# EAGLE design bluetooth-shield (EAGLE 6.5.0)
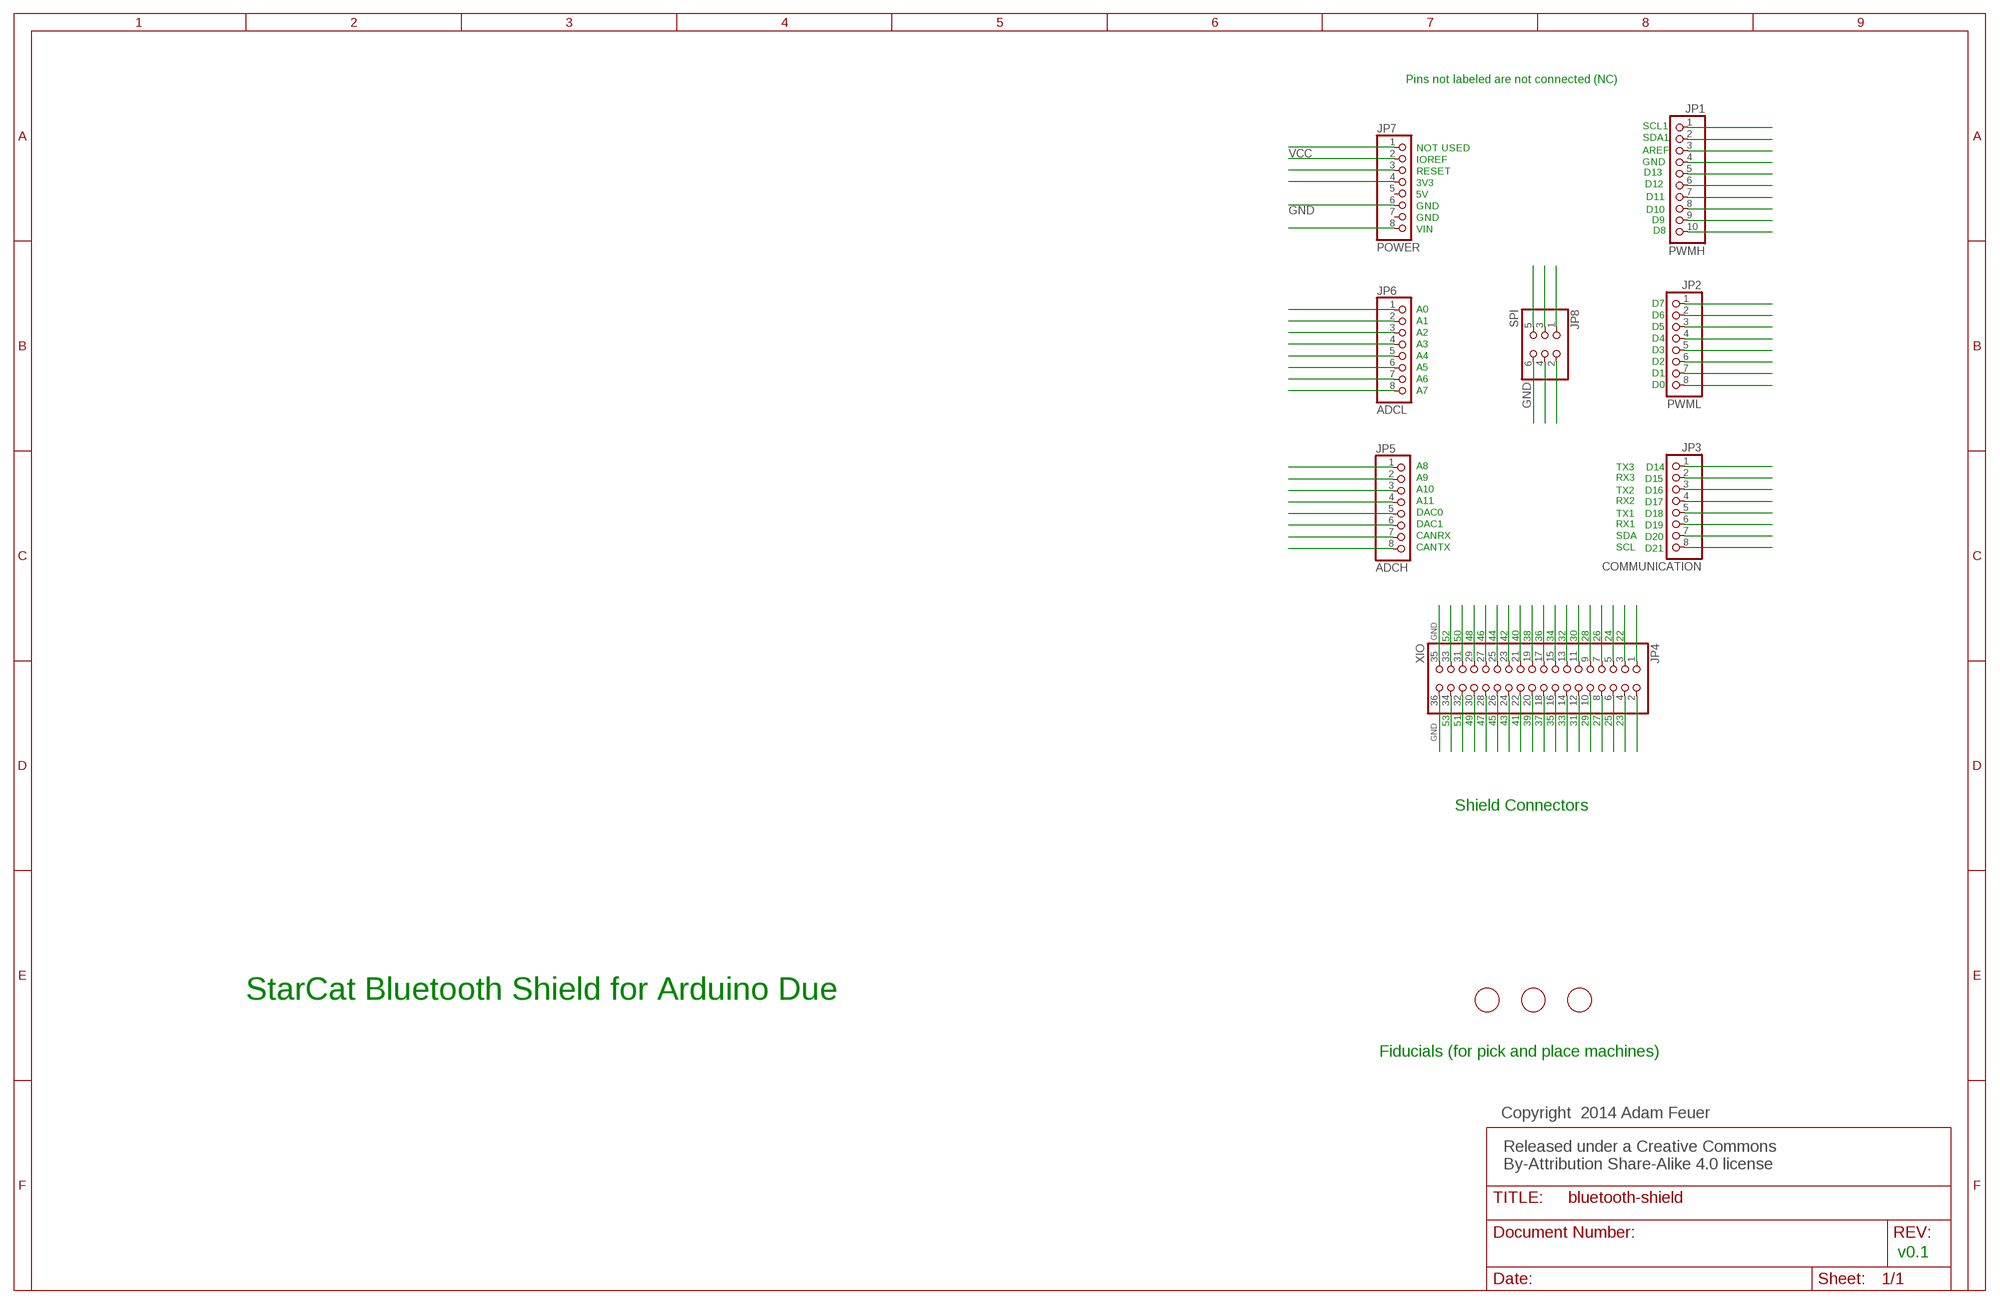
[diagram p0: schematic, sheet 1]

## Parts
JP1  PWMH  PINHD-1X10  [1X10]
JP2  PWML  PINHD-1X8  [1X08]
JP3  COMMUNICATION  PINHD-1X8  [1X08]
JP4  XIO  PINHD-2X18  [2X18]
JP5  ADCH  PINHD-1X8  [1X08]
JP6  ADCL  PINHD-1X8  [1X08]
JP7  POWER  PINHD-1X8  [1X08]
JP8  SPI  PINHD-2X3  [2X03]
U$2  FIDUCIAL  [FIDUCIAL_1MM]
U$5  FIDUCIAL  [FIDUCIAL_1MM]
U$6  FIDUCIAL  [FIDUCIAL_1MM]

## Nets
D38: JP4.19
D39: JP4.20
D40: JP4.21
D41: JP4.22
D42: JP4.23
D43: JP4.24
D44: JP4.25
D45: JP4.26
GND [GND]: JP4.35 JP4.36 JP8.6
N$1: JP1.9
N$2: JP5.1
N$3: JP7.1
N$4: JP3.7
N$5: JP2.7
N$7: JP1.3
N$8: JP1.4
N$9: JP1.5
N$10: JP1.6
N$11: JP1.7
N$12: JP1.10
N$13: JP2.1
N$14: JP2.2
N$15: JP2.3
N$16: JP2.5
N$17: JP2.6
N$18: JP2.8
N$19: JP3.1
N$22: JP3.2
N$25: JP3.5
N$26: JP3.6
N$32: JP3.8
N$37: JP5.8
N$43: JP5.7
N$44: JP5.6
N$55: JP5.5
N$56: JP5.4
N$57: JP5.3
N$58: JP5.2
N$65: JP6.4
N$66: JP6.3
N$68: JP6.2
N$69: JP7.8
N$71: JP7.6
N$72: JP7.3
N$73: JP4.34
N$74: JP4.32
N$89: JP4.18
N$91: JP4.16
N$92: JP4.10
N$93: JP4.3
N$94: JP4.9
N$96: JP4.15
N$97: JP4.17
N$109: JP4.31
N$110: JP6.6
N$112: JP6.7
N$115: JP4.1
N$116: JP4.2
N$569: JP6.8
N$571: JP7.4
N$572: JP6.1
N$573: JP6.5
N$574: JP1.1
N$575: JP1.2
N$576: JP1.8
N$577: JP2.4
N$578: JP3.3
N$579: JP3.4
N$580: JP4.5
N$581: JP4.7
N$582: JP4.11
N$583: JP4.13
N$584: JP4.27
N$585: JP4.29
N$586: JP4.33
N$587: JP4.4
N$588: JP4.6
N$589: JP4.8
N$590: JP4.12
N$591: JP4.14
N$592: JP4.30
N$601: JP4.28
RESET: JP8.5
SPI0_MISO: JP8.1
SPI0_MOSI: JP8.4
SPI0_SCK: JP8.3
VCC: JP7.2
VCC_5V: JP8.2
Unconnected: JP7.5 JP7.7

## Notes on the sheet
- Pins not labeled are not connected (NC)
- SCL1
- SDA1
- NOT USED | AREF
- IOREF | GND
- RESET | D13
- 3V3 | D12
- 5V | D11
- GND
- D10
- GND | D9
- VIN | D8
- D7
- A0
- D6
- A1
- D5
- A2
- D4
- A3
- D3
- A4
- D2
- A5
- D1
- A6
- D0
- A7
- A8 | TX3 | D14
- A9 | RX3 | D15
- A10 | TX2 | D16
- A11 | RX2 | D17
- DAC0 | TX1 | D18
- DAC1 | RX1 | D19
- CANRX | SDA | D20
- CANTX | SCL | D21
- 52 | 50 | 48 | 46 | 44 | 42 | 40 | 38 | 36 | 34 | 32 | 30 | 28 | 26 | 24 | 22
- 53 | 51 | 49 | 47 | 45 | 43 | 41 | 39 | 37 | 35 | 33 | 31 | 29 | 27 | 25 | 23
- Shield Connectors
- StarCat Bluetooth Shield for Arduino Due
- Fiducials (for pick and place machines)
- Copyright  2014 Adam Feuer
- Released under a Creative Commons 
  By-Attribution Share-Alike 4.0 license
- v0.1

## Library data of the parts
JP1 = SmartPrj:PINHD-1X10: PIN HEADER
JP2 JP3 JP5-JP7 = SmartPrj:PINHD-1X8: PIN HEADER
JP4 = SmartPrj:PINHD-2X18: PIN HEADER
JP8 = SmartPrj:PINHD-2X3: PIN HEADER
U$2 U$5 U$6 = adafruit:FIDUCIAL: For use by pick and place machines to calibrate the vision/machine, 1mm By microbuilder.eu

## Net classes
0 USB_A: width 0.305 mm, drill 0.305 mm, clearance 0.508 mm
1 5V: width 0.305 mm, drill 0.305 mm, clearance 0.305 mm
2 GND: width 0.305 mm, drill 0.305 mm, clearance 0.305 mm

## Board
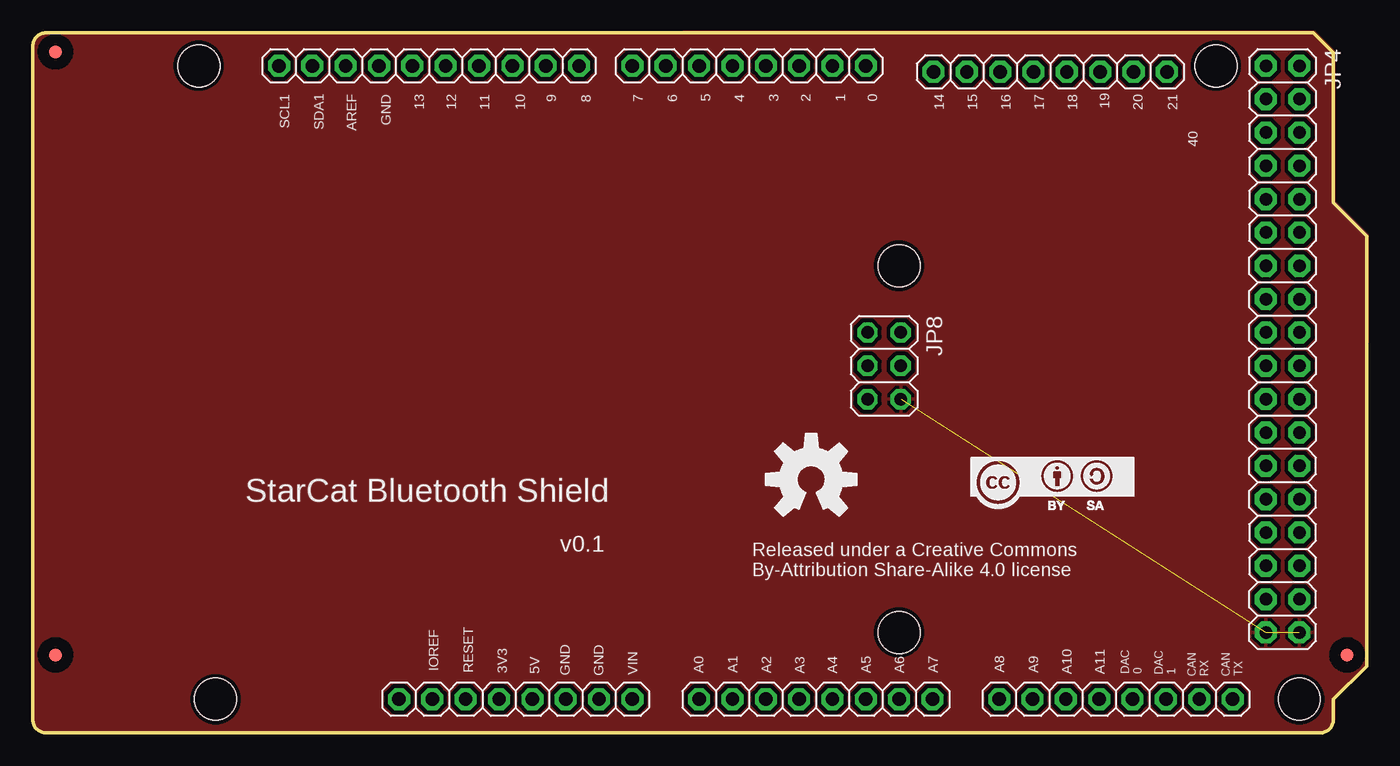
[diagram p1: board, top side]
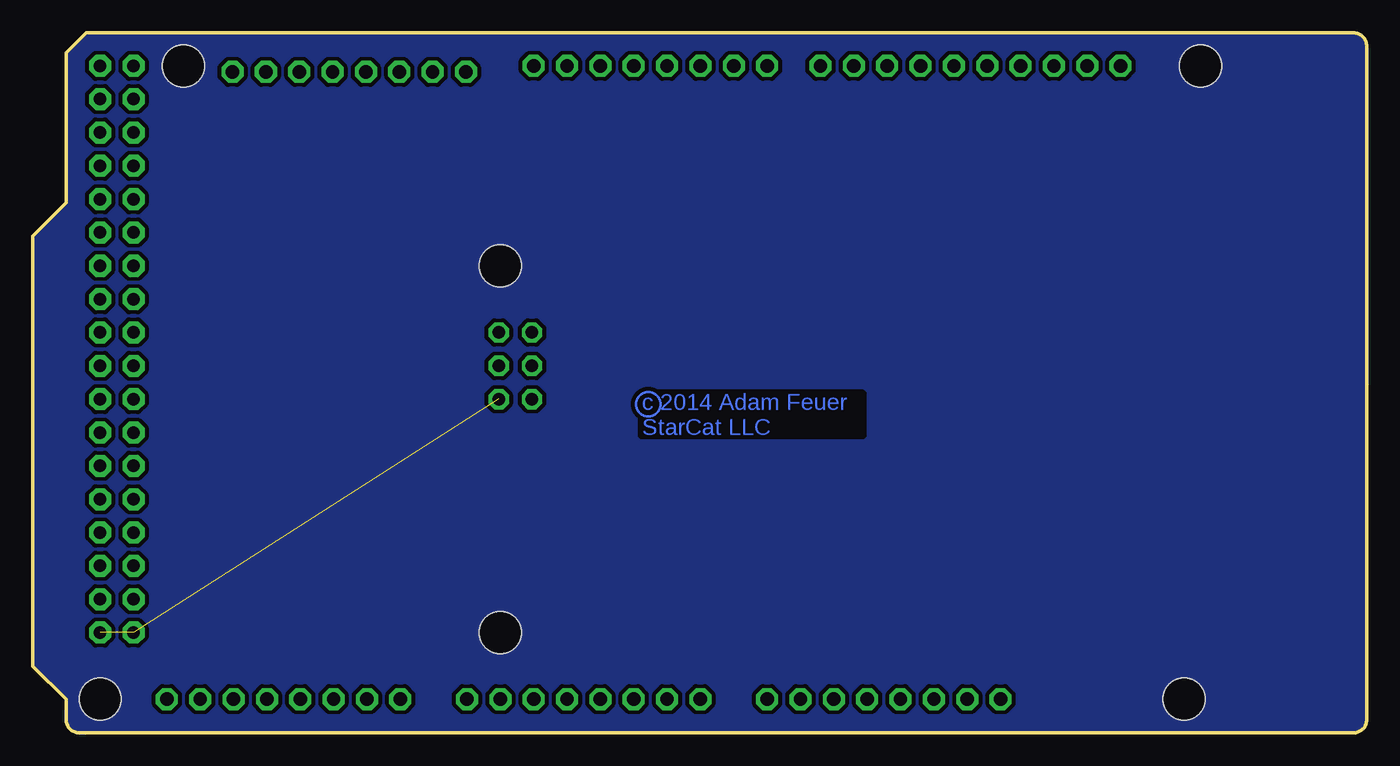
[diagram p2: board, bottom side, seen from below]

Size 101.6 x 53.34 mm. Coordinates in mm from the lower left corner, seen from the top.
Outline: 97.54,53.34 99.06,51.82 99.06,40.39 101.6,37.85 101.6,5.08 99.06,2.54 99.06,1 arc-90 98.06,0 1,0 arc-90 0,1 0,52.34 arc-90 1,53.34 97.54,53.34
Copper layers (1*16): Top 0.0356mm / dielectric 63mil / Bottom 0.0356mm
Design rules "advanced-circuits-2-layer": minimum track width 6mil, minimum drill 15mil, track to track 6mil, track to pad 6mil, pad to pad 6mil, via to via 6mil, smd to smd 6mil, copper to edge 0mil, drill to drill 6mil, minimum pad ring 10mil, minimum via ring 8mil, stop-mask expansion 4mil, vias tented up to drill 0mil, thermal gap 10mil
Holes 3.2 mm at 96.47,2.57 12.65,50.83 90.12,50.83 13.92,2.57 65.99,35.59 65.99,7.65

### Footprints (pad centres in the part's own frame; a part is rotated, then mirrored left to right if it is on the bottom)
1X10 = drill 1.016 pad 1.676 octagon: 1 -11.43,0; 2 -8.89,0; 3 -6.35,0; 4 -3.81,0; 5 -1.27,0; 6 1.27,0; 7 3.81,0; 8 6.35,0; 9 8.89,0; 10 11.43,0
1X08 = drill 1.016 pad 1.676 octagon: 1 -8.89,0; 2 -6.35,0; 3 -3.81,0; 4 -1.27,0; 5 1.27,0; 6 3.81,0; 7 6.35,0; 8 8.89,0
2X18 = drill 0.95 pad 1.676 octagon: 1 -21.59,-1.27; 2 -21.59,1.27; 3 -19.05,-1.27; 4 -19.05,1.27; 5 -16.51,-1.27; 6 -16.51,1.27; 7 -13.97,-1.27; 8 -13.97,1.27; 9 -11.43,-1.27; 10 -11.43,1.27; 11 -8.89,-1.27; 12 -8.89,1.27; 13 -6.35,-1.27; 14 -6.35,1.27; 15 -3.81,-1.27; 16 -3.81,1.27; 17 -1.27,-1.27; 18 -1.27,1.27; 19 1.27,-1.27; 20 1.27,1.27; 21 3.81,-1.27; 22 3.81,1.27; 23 6.35,-1.27; 24 6.35,1.27; 25 8.89,-1.27; 26 8.89,1.27; 27 11.43,-1.27; 28 11.43,1.27; 29 13.97,-1.27; 30 13.97,1.27; 31 16.51,-1.27; 32 16.51,1.27; 33 19.05,-1.27; 34 19.05,1.27; 35 21.59,-1.27; 36 21.59,1.27
2X03 = drill 0.95 pad 1.55 octagon: 1 -2.54,-1.27; 2 -2.54,1.27; 3 0,-1.27; 4 0,1.27; 5 2.54,-1.27; 6 2.54,1.27
FIDUCIAL_1MM = smd 1 x 1: 1 0,0

### Placement (x,y rotation side)
JP1  30.18,50.83 0 top
JP2  54.56,50.83 0 top
JP3  77.5,50.37 0 top
JP4  95.2,29.24 270 top
JP5  82.5,2.57 0 top
JP6  59.64,2.57 0 top
JP7  36.78,2.57 0 top
JP8  64.85,27.97 270 top
U$1  [OSHW-LOGO-L]  59.28,19.3 0 top
U$2  1.73,51.89 0 top
U$5  1.73,5.94 0 top
U$6  100.1,5.94 0 top
U$8  [CC-BY-SA]  71.32,16.71 0 top

### Tracks (layer width: path | path; a pad name or v marks a point on that pad's centre or on a via)
5V
  pour Bottom (rank 3): 1.19,0 97.54,0 arc90 99.09,0.94 99.06,2.54 101.57,5.16 101.6,37.82 99.06,40.39 99.06,51.79 97.28,53.37 1.12,53.34 arc90 -0.03,51.97 0,1.09 0.03,0.86 arc90
GND  (2 unrouted)
  pour Top (isolate 0.305): 0.03,52.4 0.03,1.09 arc90 1.04,0.08 98.07,0.08 arc90 99.09,1.09 99.09,2.59 101.57,5.08 101.63,37.92 99.09,40.46 99.09,51.89 97.56,53.42 1.45,53.34 arc90
(copper drawn outside any net)
  shapes: Bottom circle x1

### Text on the board
Bottom: c 2014 Adam Feuer / StarCat LLC
tPlace: SCL1 | SDA1 | AREF | GND | 13 | 12 | 11 | 10 | 9 | 8 | 7 | 6 | 5 | 4 | 3 | 2 | 1 | 0 | 14 | 15 | 16 | 17 | 18 | 19 | 20 | 21 | 40 | StarCat Bluetooth Shield | v0.1 | Released under a Creative Commons / By-Attribution Share-Alike 4.0 license | IOREF | RESET | 3V3 | A0 | A1 | A2 | A5 | A6 | A7 | A8 | A9 | 5V | GND | GND | VIN | A3 | A4 | A10 | A11 | DAC / 0 | DAC / 1 | CAN / RX | CAN / TX